# EAGLE design RapideUSBII (EAGLE 9.5.2)
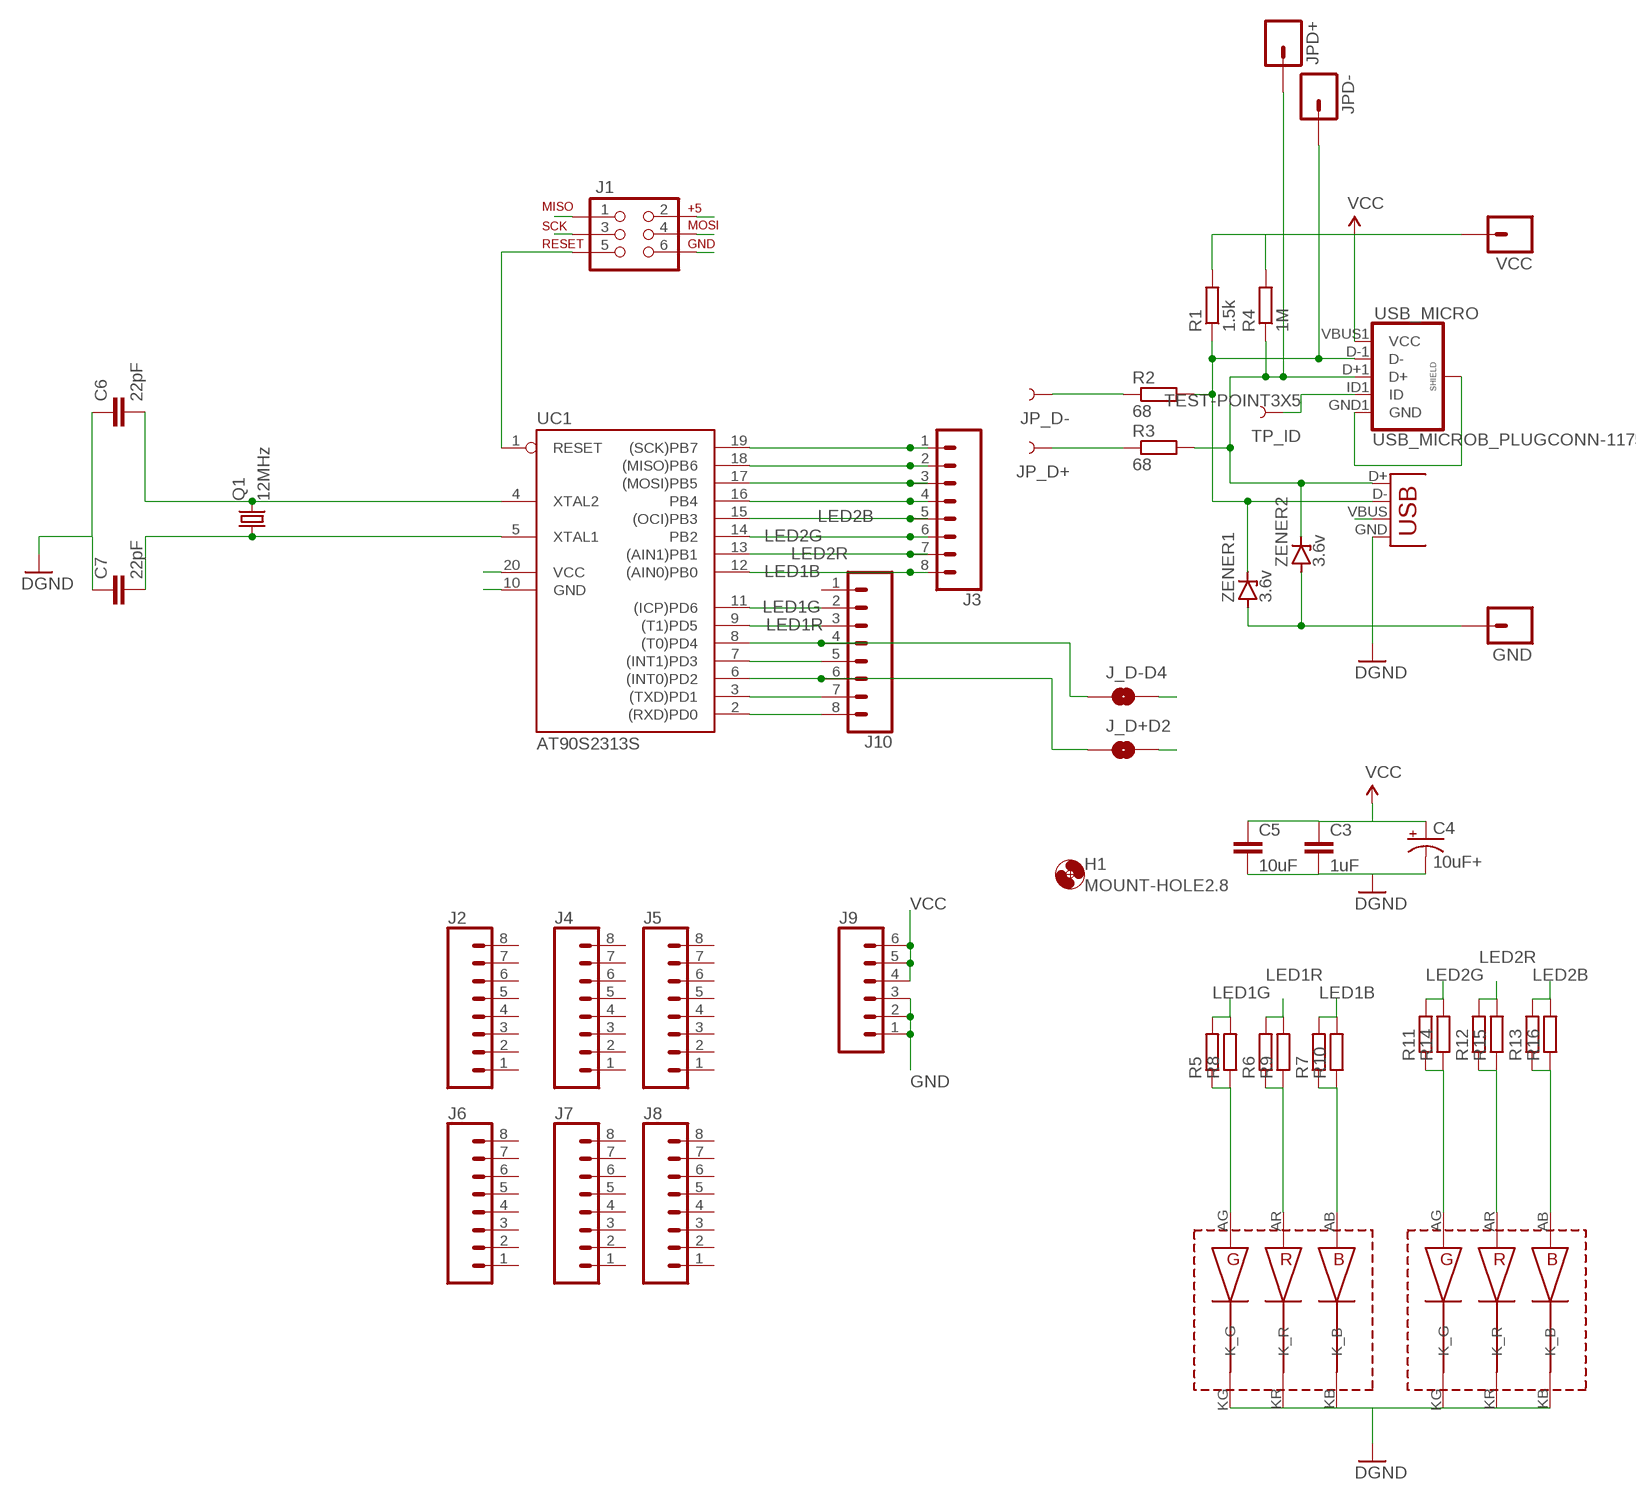
[diagram p0: schematic, sheet 1]

## Parts
C3  1uF  CAP1206  [1206]
C4  10uF+  CAP_POLE  [PANASONIC_E]
C5  10uF  CAP0805  [0805]
C6  22pF  CAP1206  [1206]
C7  22pF  CAP1206  [1206]
GND  M01PTH_NO_SILK_YES_STOP  [1X01_NO_SILK]
H1  MOUNT-HOLE2.8  [2,8]
J1  AVR_SPI_PRG_6PTH  [2X3]
J2  CONN_08NO_SILK_FEMALE_PTH  [1X08_NO_SILK]
J3  CONN_08SMD-STRAIGHT-ALT-FEMALE  [1X08_SMD_ALT]
J4  CONN_08NO_SILK_FEMALE_PTH  [1X08_NO_SILK]
J5  CONN_08NO_SILK_FEMALE_PTH  [1X08_NO_SILK]
J6  CONN_08NO_SILK_FEMALE_PTH  [1X08_NO_SILK]
J7  CONN_08NO_SILK_FEMALE_PTH  [1X08_NO_SILK]
J8  CONN_08NO_SILK_FEMALE_PTH  [1X08_NO_SILK]
J9  CONN_06NO_SILK_FEMALE_PTH  [1X06_NO_SILK]
J10  CONN_08SMD-STRAIGHT-FEMALE  [1X08_SMD]
J_D+D2  JUMPER-PAD-2-NOYES_SILK  [PAD-JUMPER-2-NO_YES_SILK]
J_D-D4  JUMPER-PAD-2-NOYES_SILK  [PAD-JUMPER-2-NO_YES_SILK]
JP_D+  TEST-POINT3X5  [PAD.03X.05]
JP_D-  TEST-POINT3X5  [PAD.03X.05]
JPD+  M01PTH_NO_SILK_YES_STOP  [1X01_NO_SILK]
JPD-  M01PTH_NO_SILK_YES_STOP  [1X01_NO_SILK]
LED1  RGB-SMT-SQUARE6X6MM  [SMT-SQUARE6]
LED2  RGB-SMT-SQUARE5X5MM  [SMT-SQUARE5]
Q1  12MHz  CRYSTALPTH-HC49UV  [HC49U]
R1  1.5k  R-EU_0204/2V  [0204V]
R2  68  R-EU_0204/2V  [0204V]
R3  68  R-EU_0204/2V  [0204V]
R4  1M  R-EU_0204/2V  [0204V]
R5  R-EU_0204/2V  [0204V]
R6  R-EU_0204/2V  [0204V]
R7  R-EU_0204/2V  [0204V]
R8  R-EU_M1206  [M1206]
R9  R-EU_M1206  [M1206]
R10  R-EU_M1206  [M1206]
R11  R-EU_0204/2V  [0204V]
R12  R-EU_0204/2V  [0204V]
R13  R-EU_0204/2V  [0204V]
R14  R-EU_M1206  [M1206]
R15  R-EU_M1206  [M1206]
R16  R-EU_M1206  [M1206]
TP_ID  TEST-POINT3X5  [PAD.03X.05]
UC1  AT90S2313S  [SO20L]
USB_MICRO  USB_MICROB_PLUGCONN-11752  [USB-B-MICRO-SMD_V03]
USB_MINI  USBSMD  [USB-MINIB]
VCC  M01PTH_NO_SILK_YES_STOP  [1X01_NO_SILK]
ZENER1  3.6v  ZENER-DIODEZD-2.5  [ZDIO-2.5]
ZENER2  3.6v  ZENER-DIODEZD-2.5  [ZDIO-2.5]

## Nets
D0: J10.8 UC1.2((RXD)PD0)
D1: J10.7 UC1.3((TXD)PD1)
D2: J10.6 J_D+D2.1 UC1.6((INT0)PD2)
D3: J10.5 UC1.7((INT1)PD3)
D4: J10.4 J_D-D4.1 UC1.8((T0)PD4)
D+: J_D+D2.2 JP_D+.P$1 R3.1
D-: J_D-D4.2 JP_D-.P$1 R2.1
GND: C3.2 C4.- C5.2 C6.1 C7.1 GND.1 J1.6 J9.1 J9.2 J9.3 LED1.KB(K_B) LED1.KG(K_G) LED1.KR(K_R) LED2.KB(K_B) LED2.KG(K_G) LED2.KR(K_R) UC1.10(GND) USB_MICRO.GND1(GND) USB_MICRO.SHIELD1(SHIELD) USB_MICRO.SHIELD2(SHIELD) USB_MICRO.SHIELD3(SHIELD) USB_MINI.GND ZENER1.A ZENER2.A ; supply symbol labelled DGND
LED1B: J3.8 R7.2 R10.2 UC1.12((AIN0)PB0)
LED1G: J10.2 R5.2 R8.2 UC1.11((ICP)PD6)
LED1R: J10.3 R6.2 R9.2 UC1.9((T1)PD5)
LED2B: J3.5 R13.2 R16.2 UC1.15((OCI)PB3)
LED2G: J3.6 R11.2 R14.2 UC1.14(PB2)
LED2R: J3.7 R12.2 R15.2 UC1.13((AIN1)PB1)
MISO: J1.1 J3.2 UC1.18((MISO)PB6)
MOSI: J1.4 J3.3 UC1.17((MOSI)PB5)
N$1: J3.4 UC1.16(PB4)
N$14: TP_ID.P$1 USB_MICRO.ID1(ID)
N$15: LED1.AG(ANODE_G) R5.1 R8.1
N$17: LED1.AR(ANODE_R) R6.1 R9.1
N$18: LED1.AB(ANODE_B) R7.1 R10.1
N$19: LED2.AG(ANODE_G) R11.1 R14.1
N$20: LED2.AR(ANODE_R) R12.1 R15.1
N$21: LED2.AB(ANODE_B) R13.1 R16.1
N$22: C7.2 Q1.1 UC1.5(XTAL1)
N$23: C6.2 Q1.2 UC1.4(XTAL2)
RESET: J1.5 UC1.1(RESET)
SCK: J1.3 J3.1 UC1.19((SCK)PB7)
USBD+: JPD+.1 R3.2 R4.1 USB_MICRO.D+1(D+) USB_MINI.D+ ZENER2.C
USBD-: JPD-.1 R1.1 R2.2 USB_MICRO.D-1(D-) USB_MINI.D- ZENER1.C
VCC: C3.1 C4.+ C5.1 J1.2 J9.4 J9.5 J9.6 R1.2 R4.2 UC1.20(VCC) USB_MICRO.VBUS1(VCC) USB_MINI.VBUS VCC.1
Unconnected: J2.1 J2.2 J2.3 J2.4 J2.5 J2.6 J2.7 J2.8 J4.1 J4.2 J4.3 J4.4 J4.5 J4.6 J4.7 J4.8 J5.1 J5.2 J5.3 J5.4 J5.5 J5.6 J5.7 J5.8 J6.1 J6.2 J6.3 J6.4 J6.5 J6.6 J6.7 J6.8 J7.1 J7.2 J7.3 J7.4 J7.5 J7.6 J7.7 J7.8 J8.1 J8.2 J8.3 J8.4 J8.5 J8.6 J8.7 J8.8 J10.1

## Library data of the parts
C3 C5-C7 = SparkFun-Capacitors:CAP: Capacitor Standard 0603 ceramic capacitor, and 0.1" leaded capacitor.
C4 = SparkFun-Capacitors:CAP_POL: Capacitor Polarized These are standard SMD and PTH capacitors. Normally 10uF, 47uF, and 100uF in electrolytic and tantalum varieties. Always verify the external diameter of the through hole cap, it varies with capacity, voltage, and manufacturer. The EIA devices should be standard.
GND JPD+ JPD- VCC = SparkFun-Connectors:M01: Header 1 Standard 1-pin 0.1" header. Use with straight break away headers (SKU : PRT-00116), right angle break away headers (PRT-00553), swiss pins (PRT-00743), machine pins (PRT-00117), and female headers (PRT-00115).
H1 = holes:MOUNT-HOLE: MOUNTING HOLE with drill center marker
J1 = SparkFun-Connectors:AVR_SPI_PRG_6: AVR ISP 6 Pin This is the reduced ISP connector for AVR programming. Common on Arduino. This footprint will take up less PCB space and can be used with a 10-pin to 6-pin adapter such as SKU: BOB-08508 **Special note about "TEST_POINT" package. The stop mask is on the top side, so if you want your programming test points to be on the bottom of your board, make sure to place this package on the bottom side of the board. This also ensure that the orientation to program from the bottom side will be correct.
J2 J4-J8 = SparkFun-Connectors:CONN_08: Multi connection point. Often used as Generic Header-pin footprint for 0.1 inch spaced/style header connections On any of the 0.1 inch spaced packages, you can populate with these: Break Away Headers - Straight <https://www.sparkfun.com/products/116> (PRT-00116) Break Away Male Headers - Right Angle <https://www.sparkfun.com/products/553> (PRT-00553) Female Headers <https://www.sparkfun.com/products/115> (PRT-00115) Break Away Headers - Machine Pin <https://www.sparkfun.com/products/117> (PRT-00117) Break Away Female Headers - Swiss Machine Pin <https://www.sparkfun.com/products/743> (PRT-00743) Arduino Stackable Header - 8 Pin <https://www.sparkfun.com/products/9279> (PRT-09279) For SCREWTERMINALS and SPRING TERMINALS visit here: Screw Terimnals on SparkFun.com <https://www.sparkfun.com/search/results?term=Screw+Terminals> (5mm/3.5mm/2.54mm spacing) This device is also useful as a general connection point to wire up your design to another part of your project. Our various solder wires solder well into these plated through hole pads. Hook-Up Wire - Assortment (Stranded, 22 AWG) <https://www.sparkfun.com/products/11375> (PRT-11375) Hook-Up Wire - Assortment (Solid Core, 22 AWG) <https://www.sparkfun.com/products/11367> (PRT-11367) View the entire wire category on our website here <https://www.sparkfun.com/categories/141> Special notes: Molex polarized connector foot print use with SKU : PRT-08231 with associated crimp pins and housings. 1MM SMD Version SKU: PRT-10208 NOTES ON THE VARIANTS LOCK and LOCK_LONGPADS... This footprint was designed to help hold the alignment of a through-hole component (i.e. 6-pin header) while soldering it into place. You may notice that each hole has been shifted either up or down by 0.005 of an inch from it's more standard position (which is a perfectly straight line). This slight alteration caused the pins (the squares in the middle) to touch the edges of the holes. Because they are alternating, it causes a "brace" to hold the component in place. 0.005 has proven to be the perfect amount of "off-center" position when using our standard breakaway headers. Although looks a little odd when you look at the bare footprint, once you have a header in there, the alteration is very hard to notice. Also,if you push a header all the way into place, it is covered up entirely on the bottom side.; PROD_ID: CONN-08438
J3 J10 = SparkFun-Connectors:CONN_08: Multi connection point. Often used as Generic Header-pin footprint for 0.1 inch spaced/style header connections On any of the 0.1 inch spaced packages, you can populate with these: Break Away Headers - Straight <https://www.sparkfun.com/products/116> (PRT-00116) Break Away Male Headers - Right Angle <https://www.sparkfun.com/products/553> (PRT-00553) Female Headers <https://www.sparkfun.com/products/115> (PRT-00115) Break Away Headers - Machine Pin <https://www.sparkfun.com/products/117> (PRT-00117) Break Away Female Headers - Swiss Machine Pin <https://www.sparkfun.com/products/743> (PRT-00743) Arduino Stackable Header - 8 Pin <https://www.sparkfun.com/products/9279> (PRT-09279) For SCREWTERMINALS and SPRING TERMINALS visit here: Screw Terimnals on SparkFun.com <https://www.sparkfun.com/search/results?term=Screw+Terminals> (5mm/3.5mm/2.54mm spacing) This device is also useful as a general connection point to wire up your design to another part of your project. Our various solder wires solder well into these plated through hole pads. Hook-Up Wire - Assortment (Stranded, 22 AWG) <https://www.sparkfun.com/products/11375> (PRT-11375) Hook-Up Wire - Assortment (Solid Core, 22 AWG) <https://www.sparkfun.com/products/11367> (PRT-11367) View the entire wire category on our website here <https://www.sparkfun.com/categories/141> Special notes: Molex polarized connector foot print use with SKU : PRT-08231 with associated crimp pins and housings. 1MM SMD Version SKU: PRT-10208 NOTES ON THE VARIANTS LOCK and LOCK_LONGPADS... This footprint was designed to help hold the alignment of a through-hole component (i.e. 6-pin header) while soldering it into place. You may notice that each hole has been shifted either up or down by 0.005 of an inch from it's more standard position (which is a perfectly straight line). This slight alteration caused the pins (the squares in the middle) to touch the edges of the holes. Because they are alternating, it causes a "brace" to hold the component in place. 0.005 has proven to be the perfect amount of "off-center" position when using our standard breakaway headers. Although looks a little odd when you look at the bare footprint, once you have a header in there, the alteration is very hard to notice. Also,if you push a header all the way into place, it is covered up entirely on the bottom side.; PROD_ID: CONN-10204; SF_ID: PRT-11543
J9 = SparkFun-Connectors:CONN_06: Multi connection point. Often used as Generic Header-pin footprint for 0.1 inch spaced/style header connections On any of the 0.1 inch spaced packages, you can populate with these: Break Away Headers - Straight <https://www.sparkfun.com/products/116> (PRT-00116) Break Away Male Headers - Right Angle <https://www.sparkfun.com/products/553> (PRT-00553) Female Headers <https://www.sparkfun.com/products/115> (PRT-00115) Break Away Headers - Machine Pin <https://www.sparkfun.com/products/117> (PRT-00117) Break Away Female Headers - Swiss Machine Pin <https://www.sparkfun.com/products/743> (PRT-00743) Arduino Stackable Header - 6 Pin <https://www.sparkfun.com/products/9280> (PRT-09280) For SCREWTERMINALS and SPRING TERMINALS visit here: Screw Terimnals on SparkFun.com <https://www.sparkfun.com/search/results?term=Screw+Terminals> (5mm/3.5mm/2.54mm spacing) This device is also useful as a general connection point to wire up your design to another part of your project. Our various solder wires solder well into these plated through hole pads. Hook-Up Wire - Assortment (Stranded, 22 AWG) <https://www.sparkfun.com/products/11375> (PRT-11375) Hook-Up Wire - Assortment (Solid Core, 22 AWG) <https://www.sparkfun.com/products/11367> (PRT-11367) View the entire wire category on our website here <https://www.sparkfun.com/categories/141>; PROD_ID: CONN-08437
J_D+D2 J_D-D4 = SparkFun-Passives:JUMPER-PAD-2-NO
JP_D+ JP_D- = SparkFun-Passives:TEST-POINT: Bare copper test points for troubleshooting or ICT
LED1 LED2 = kalshagar:RGB-SMT-SQUARE: A simple SMD RGB led square in about 6x6.6mm. Different models possible, be careful of the pinout (can be interverted so annotate your schema) Sold here http://akizukidenshi.com/catalog/g/gI-02225/
Q1 = SparkFun-Clocks:CRYSTAL: Crystals (Generic) These are passive quartz crystals, which can be used as a clock source for a microcontroller. Crystal's are two-terminal devices. They require external "load" capacitors to generate an oscillating signal.
R1-R16 = resistor:R-EU_: RESISTOR, European symbol
TP_ID = SparkFun-Connectors:TEST-POINT: SparkFun Test Points Bare copper test points for troubleshooting or In-Circuit-Testing. These are used by our Production team for verifying production board runs using pogo-pins on test beds. SparkFun Products: SparkFun LSM9DS1 Breakout <https://www.sparkfun.com/products/13284> SparkFun PSOC <https://www.sparkfun.com/products/13714> SparkFun Load Cell Amplifier <https://www.sparkfun.com/products/13879>
UC1 = atmel:AT90S2313: MICROCONTROLLER 2 Kbytes FLASH 128 bytes SRAM 128 bytes EEPROM UART; OC_FARNELL: unknown; OC_NEWARK: unknown
USB_MICRO = SparkFun-Connectors:USB_MICROB_PLUG: USB Micro-B connectors Some male, some female. Watch your step!; PROD_ID: CONN-11752
USB_MINI = SparkFun-Connectors:USB: USB Connectors USB-B-PTH is fully proven SKU : PRT-00139/CONN-08278 USB-miniB is fully proven SKU : PRT-00587 USB-A-PCB is untested. USB-A-H is throughly reviewed, but untested. Spark Fun Electronics SKU : PRT-00437 USB-B-SMT is throughly reviewed, but untested. Needs silkscreen touching up. USB-A-S has not been used/tested USB-MB-H has not been used/tested USB-MICROB has been used. CONN-09505; PROD_ID: CONN-08193
ZENER1 ZENER2 = diode:ZENER-DIODE: Z-Diode

## Board
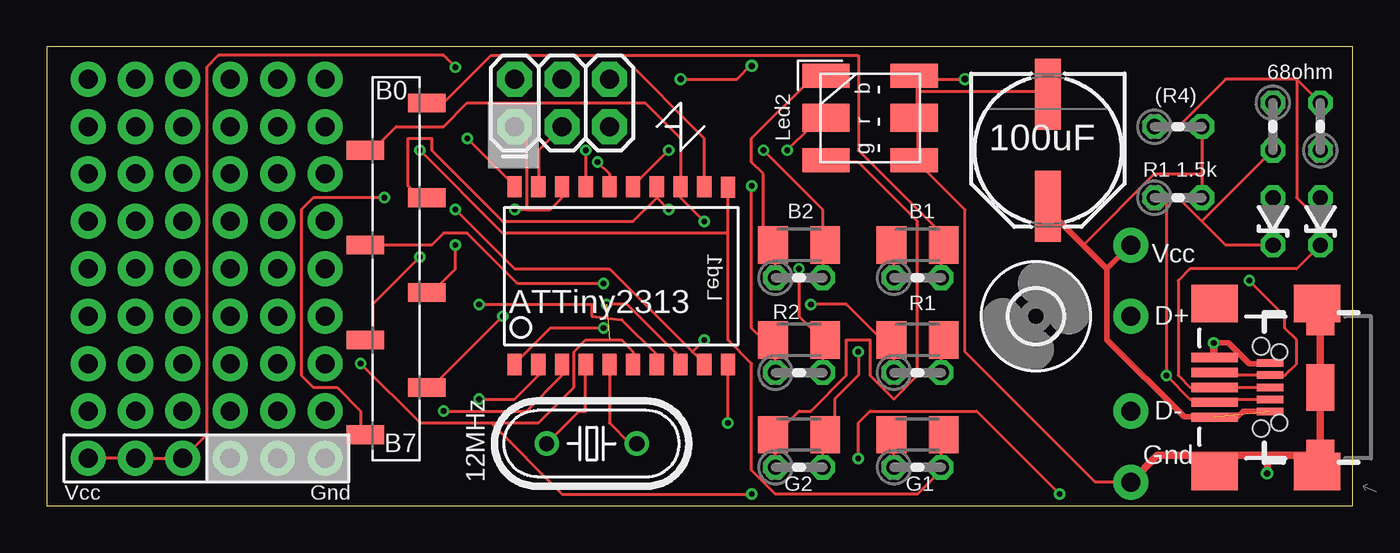
[diagram p1: board, top side]
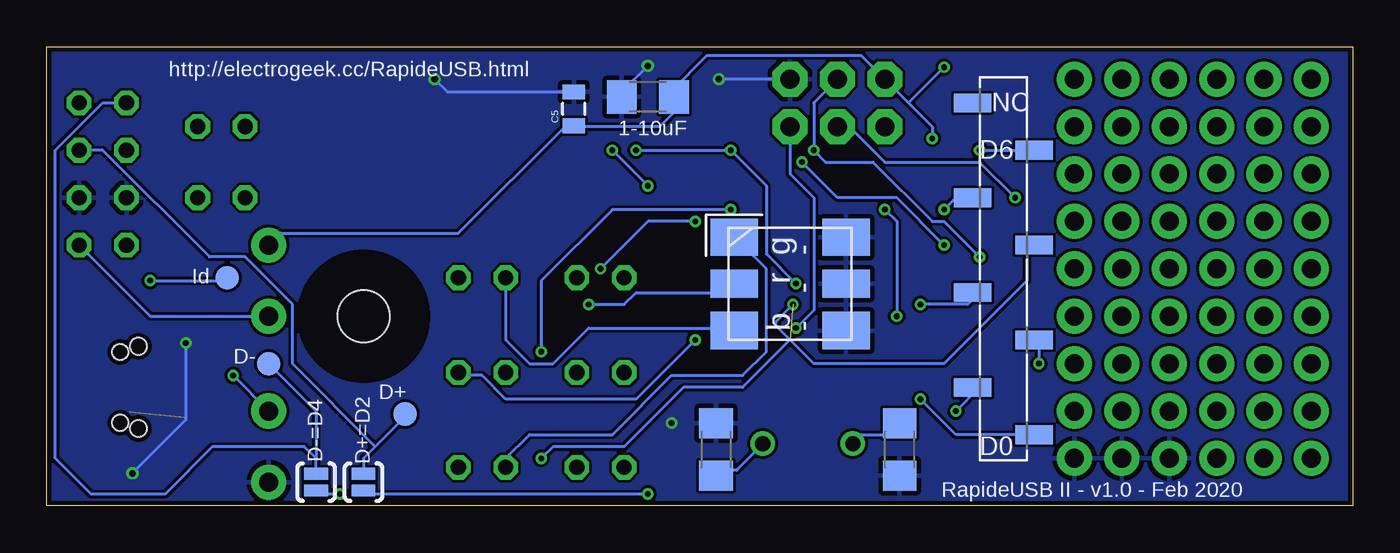
[diagram p2: board, bottom side, seen from below]

Size 70 x 24.6 mm. Coordinates in mm from the lower left corner, seen from the top.
Outline: 0,0 70,0 70,24.6 0,24.6 0,0
Copper layers (1*16): Top 0.035mm / dielectric 1.5mm / Bottom 0.035mm
Design rules "SeeedStudio_2layer_DRU_no_angle_20140221": minimum track width 6mil, minimum drill 12mil, track to track 6mil, track to pad 6mil, pad to pad 6mil, via to via 6mil, smd to smd 0mil, copper to edge 10mil, drill to drill 10mil, minimum pad ring 10mil, minimum via ring 6mil, stop-mask expansion 2mil, vias tented up to drill 100mil, thermal gap 10mil

### Footprints (pad centres in the part's own frame; a part is rotated, then mirrored left to right if it is on the bottom)
1206 = smd 1.6 x 1.8: 1 -1.4,0; 2 1.4,0
PANASONIC_E = smd 3.8 x 1.4: + 3,0; - -3,0
0805 = smd 0.8 x 1.2: 1 -0.9,0; 2 0.9,0
1X01_NO_SILK = drill 1.016 pad 1.88: 1 0,0
2,8 = hole 2.8: 0,0
2X3 = drill 1.016 pad 1.88 octagon: 1 0,0; 2 0,2.54; 3 2.54,0; 4 2.54,2.54; 5 5.08,0; 6 5.08,2.54
1X08_NO_SILK = drill 1.016 pad 1.88: 1 0,0; 2 2.54,0; 3 5.08,0; 4 7.62,0; 5 10.16,0; 6 12.7,0; 7 15.24,0; 8 17.78,0
1X08_SMD_ALT = smd 1 x 2: 1 0,-1.65; 2 -2.54,1.65; 3 -5.08,-1.65; 4 -7.62,1.65; 5 -10.16,-1.65; 6 -12.7,1.65; 7 -15.24,-1.65; 8 -17.78,1.65
1X06_NO_SILK = drill 1.016 pad 1.88: 1 0,0; 2 2.54,0; 3 5.08,0; 4 7.62,0; 5 10.16,0; 6 12.7,0
1X08_SMD = smd 1 x 2: 1 0,1.65; 2 -2.54,-1.65; 3 -5.08,1.65; 4 -7.62,-1.65; 5 -10.16,1.65; 6 -12.7,-1.65; 7 -15.24,1.65; 8 -17.78,-1.65
PAD-JUMPER-2-NO_YES_SILK = smd 0.635 x 1.27: 1 -0.45,0; 2 0.45,0
PAD.03X.05 = smd 1.27 x 1.27: P$1 0,0
SMT-SQUARE6 = smd 2 x 2.54: AB 0.5,3; AG 5.5,3; KB 0.5,-3; KG 5.5,-3 | smd 1.5 x 2.54: AR 3,3; KR 3,-3
SMT-SQUARE5 = smd 1.27 x 2.54: AB 4.628,4.905; AG 0.102,4.905; KB 4.628,0.175; KG 0.102,0.175 | smd 1.5 x 2.54: AR 2.365,4.905; KR 2.365,0.175
HC49U = drill 0.813: 1 -2.413,0; 2 2.413,0
0204V = drill 0.813 octagon: 1 -1.27,0; 2 1.27,0
M1206 = smd 1.6 x 2: 1 -1.4,0; 2 1.4,0
SO20L = smd 0.762 x 1.143: 1 -5.08,-5.131; 2 -3.81,-5.131; 3 -2.54,-5.131; 4 -1.27,-5.131; 5 0,-5.131; 6 1.27,-5.131; 7 2.54,-5.131; 8 3.81,-5.131; 9 5.08,-5.131; 10 6.35,-5.131; 11 6.35,4.369; 12 5.08,4.394; 13 3.81,4.394; 14 2.54,4.394; 15 1.27,4.394; 16 0,4.394; 17 -1.27,4.394; 18 -2.54,4.394; 19 -3.81,4.394; 20 -5.08,4.394
USB-B-MICRO-SMD_V03 = smd 1.4 x 0.4: D+1 2.7,0; D-1 2.7,0.65; GND1 2.7,-1.3; ID1 2.7,-0.65; VBUS1 2.7,1.3 | smd 1.5 x 1.8: SHIELD1 0,3.7; SHIELD2 0,-3.7 | smd 1.5 x 2.5: SHIELD3 0,0 | hole 0.85: 2.2,1.9; 2.2,-1.9
USB-MINIB = smd 2.5 x 0.5: D+ 2.5,0; D- 2.5,0.8; GND 2.5,-1.6; ID 2.5,-0.8; VBUS 2.5,1.6 | smd 2.5 x 2: MTN1 -3,4.5; MTN2 2.5,4.5; MTN3 -3,-4.5; MTN4 2.5,-4.5 | hole 0.9: 0,2.2; 0,-2.2
ZDIO-2.5 = drill 0.813 octagon: A 1.27,0; C -1.27,0

### Placement (x,y rotation side)
C3  37.78,21.91 180 bottom
C4  53.66,19.05 270 top
C5  41.75,21.27 90 bottom
C6  24.29,3.02 90 bottom
C7  34.13,3.02 270 bottom
GND  58.1,1.27 0 top
H1  53.02,10.16 0 top
J1  25.08,20.32 0 top
J2  14.92,5.08 90 top
J3  18.73,3.81 270 top
J4  12.38,5.08 90 top
J5  9.84,5.08 90 top
J6  7.3,5.08 90 top
J7  4.76,5.08 90 top
J8  2.22,5.08 90 top
J9  14.92,2.54 180 top
J10  18.73,21.59 90 bottom
J_D+D2  53.02,1.27 90 bottom
J_D-D4  55.56,1.27 90 bottom
JP_D+  50.8,4.92 0 bottom
JP_D-  58.1,7.62 0 bottom
JPD+  58.1,10.16 0 top
JPD-  58.1,5.08 0 top
LED1  30.16,8.89 90 bottom
LED2  46.67,18.41 90 top
Q1  29.21,3.33 180 top
R1  60.64,16.51 0 top
R2  65.72,20.32 270 top
R3  68.26,20.32 90 top
R4  60.64,20.32 0 top
R5  46.67,2.06 0 top
R6  46.67,7.14 0 top
R7  46.67,12.22 0 top
R8  46.67,3.81 0 top
R9  46.67,8.89 0 top
R10  46.67,13.97 0 top
R11  40.32,2.06 0 top
R12  40.32,7.14 0 top
R13  40.32,12.22 0 top
R14  40.32,3.81 0 top
R15  40.32,8.89 0 top
R16  40.32,13.97 0 top
TP_ID  60.32,12.22 0 bottom
U$1  [VUSB_LOGO]  56.51,16.51 0 bottom
UC1  30.16,12.7 0 top
USB_MICRO  68.26,6.35 180 top
USB_MINI  65.09,6.35 180 top
VCC  58.1,13.97 0 top
ZENER1  65.72,15.24 90 top
ZENER2  68.26,15.24 90 top

### Tracks (layer width: path | path; a pad name or v marks a point on that pad's centre or on a via)
D0  (via drill 0.3)
  Top 0.152: v23.18,5.71 25.08,5.71 26.35,6.99 UC1.2 26.35,7.62
  Bottom 0.152: v23.18,5.71 21.27,3.81 J10.8
D1  (via drill 0.3)
  Top 0.152: v21.27,5.08 25.71,5.08 27.62,6.99 UC1.3 27.62,7.62
  Bottom 0.152: v21.27,5.08 20,6.35 J10.7
D2  (via drill 0.3)
  Top 0.152: 23.81,4.45 20,4.45 v16.82,7.62 | 23.81,4.45 26.35,4.45 28.25,6.35 28.25,8.26 28.89,8.89 30.79,8.89 31.43,8.26 UC1.6 | v37.78,0.64 27.62,0.64 23.81,4.45
  Bottom 0.152: v16.82,7.62 16.82,8.89 J10.6 | v37.78,0.64 53.02,0.64 J_D+D2.1
D3  (via drill 0.3)
  Top 0.152: v23.18,10.79 29.25,10.79 29.21,10.76 29.21,10.16 30.82,9.98 32.7,8.1 UC1.7
  Bottom 0.152: v23.18,10.79 20.63,10.79 20,11.43 J10.5
D4  (via drill 0.3)  (1 unrouted)
  Top 0.152: UC1.8 33.7,7.84 33.7,8.2 31.11,10.79 v30,10.79 | v54.29,0.64 49.84,5.08 44.13,5.08 43.49,4.45 v43.49,2.54
  Bottom 0.152: v30,10.79 30.95,9.84 30.95,9.68 28.89,7.62 21.91,7.62 17.46,12.06 17.46,13.97 J10.4 | v54.29,0.64 55.56,0.64 J_D-D4.1 | v43.49,2.54 42.86,3.17 39.05,3.17 35.88,6.35 32.7,6.35 30.16,8.89
D+
  Bottom 0.152: J_D+D2.2 53.02,2.54 52.38,3.17 | 52.38,3.17 51.12,4.45 JP_D+.P$1 | R3.1 66.99,19.05 61.27,13.34 59.37,13.34 56.83,10.79 56.83,7.62 52.38,3.17
D-
  Bottom 0.152: 55.56,2.54 55.56,5.08 JP_D-.P$1 | R2.1 66.99,21.59 69.53,19.05 69.53,2.54 67.62,0.64 63.66,0.64 61.12,3.17 56.2,3.17 55.56,2.54 | J_D-D4.2 55.56,2.54
GND  (via drill 0.3, 0.35)
  Top 0.152: 46.67,22.23 46.67,20.95 LED2.KR 46.67,20.32 46.67,19.05 LED2.KG 46.67,18.41 49.21,15.88 49.21,8.26 56.2,1.27 GND.1 | 46.67,22.23 46.67,22.86 LED2.KB 46.68,22.86 v49.21,22.86 | 46.67,22.23 53.66,22.23 C4.- | v36.51,4.45 UC1.10 36.51,7.62 | 65.09,7.62 USB_MICRO.GND1 | 68.26,3.17 USB_MICRO.SHIELD1 | 62.55,7.99 USB_MINI.GND | v65.4,1.75 65.4,1.59 | v33.97,22.86 36.99,22.86 37.78,23.65 v37.78,23.57
  Top 0.305: 65.09,7.62 64.45,7.62 63.34,8.73 v62.55,8.73
  Top 0.406: USB_MICRO.SHIELD2 USB_MICRO.SHIELD3 68.26,3.17 68.26,2.7 65.4,2.7 | 65.4,2.7 59.53,2.7 GND.1 | v62.55,8.73 62.55,7.99 | v65.4,1.75 65.4,2.7
  Bottom 0.152: v62.55,8.73 62.55,4.6 v65.4,1.75 | J1.6 v33.97,22.86 | v37.78,23.57 39.18,22.17 C3.2 | v49.21,22.86 48.52,22.17 C5.2
  pour Bottom: -1.59,26.67 72.07,26.67 72.07,-1.27 -1.59,-1.27
LED1B
  Top 0.152: R7.2 47.94,13.97 | UC1.12 35.24,19.68 30.79,24.13 | 30.79,24.13 23.81,24.13 21.27,21.59 J3.8 | 47.94,13.97 47.94,14.61 43.49,19.05 43.49,24.13 30.79,24.13 | 47.94,13.97 R10.2
LED1G  (via drill 0.3)
  Top 0.152: 36.51,14.61 36.51,8.89 37.78,7.62 37.78,1.91 39.05,0.64 46.67,0.64 47.94,1.91 R5.2 47.94,3.81 R8.2 | 36.51,14.61 UC1.11 | v20,19.05 24.45,14.61 36.51,14.61
  Bottom 0.152: v20,19.05 J10.2
LED1R  (via drill 0.3)
  Top 0.152: R6.2 47.94,8.89 R9.2 | 34.6,8.26 30.16,12.7 25.08,12.7 v21.91,15.88 | 34.6,8.26 35.24,7.62 UC1.9 | 34.6,8.26 v35.24,8.89
  Bottom 0.152: v21.91,15.88 21.27,16.51 J10.3 | v35.24,8.89 38.41,5.71 45.4,5.71 46.67,6.99 47.94,6.99 R6.2
LED2B  (via drill 0.3)
  Top 0.152: v33.34,19.05 31.43,17.14 UC1.15 | v38.41,19.05 41.59,15.88 41.59,13.97 | J3.5 20.63,13.97 21.27,14.61 22.54,14.61 25.24,11.91 v29.84,11.91 | 41.59,13.97 R13.2 | 41.59,13.97 R16.2
  Bottom 0.152: v38.41,19.05 v33.34,19.05 31.43,17.14 31.43,13.49 v29.84,11.91
LED2G  (via drill 0.3)
  Top 0.152: R11.2 41.59,3.81 R14.2 42.23,3.81 42.23,5.71 43.49,6.99 v43.49,8.26 | 32.7,16.51 UC1.14 32.7,17.14 | 32.7,16.51 31.43,15.24 24.45,15.24 20.63,19.05 20.63,19.68 19.36,19.68 19.36,17.14 20,16.51 J3.6 | 32.7,16.51 v33.34,15.88
  Bottom 0.152: v43.49,8.26 43.49,12.06 39.69,15.88 v33.34,15.88
LED2R  (via drill 0.3)
  Top 0.152: R12.2 41.59,8.89 | J3.7 17.46,19.05 18.73,20.32 21.27,20.32 22.54,21.59 32.06,21.59 33.97,19.68 33.97,17.14 UC1.13 33.97,16.51 v35.24,15.24 | 41.59,8.89 40.32,10.16 v40.32,12.7 | 41.59,8.89 R15.2
  Bottom 0.152: v40.32,12.7 37.78,15.24 v35.24,15.24
MISO  (via drill 0.3)
  Top 0.152: 25.71,15.88 26.98,15.88 27.62,16.51 UC1.18 27.62,17.14 | 25.71,15.88 25.71,19.68 J1.1 | v24.45,10.16 20.63,6.35 J3.2 | 25.71,15.88 v25.08,15.88
  Bottom 0.152: v24.45,10.16 24.45,15.24 v25.08,15.88
MOSI  (via drill 0.3)
  Top 0.152: v28.89,19.05 UC1.17 | v20,13.34 17.46,10.79 17.46,8.89 J3.3
  Bottom 0.152: J1.4 28.89,21.59 v28.89,19.05 28.25,18.41 25.71,18.41 22.54,15.24 21.91,15.24 v20,13.34
N$1  (via drill 0.3)
  Top 0.152: UC1.16 30.16,17.78 v29.52,18.41 | v21.91,13.97 21.91,12.7 20.63,11.43 J3.4
  Bottom 0.152: v29.52,18.41 27.62,16.51 24.45,16.51 v21.91,13.97
N$2
  Top 0.152: 65.4,6.99 63.34,6.99
N$14  (via drill 0.3)
  Top 0.152: v64.45,12.06 66.36,10.16 66.36,9.53 66.99,8.89 66.99,7.62 66.36,6.99 65.72,6.99 USB_MICRO.ID1
  Bottom 0.152: v64.45,12.06 60.64,12.06 TP_ID.P$1
N$15
  Top 0.152: R5.1 45.4,3.81 R8.1
  Bottom 0.152: LED1.AG 32.7,13.97 31.43,12.7 31.43,8.26 32.7,6.99 36.51,6.99 39.69,3.81 44.13,3.81 45.4,2.54 R5.1
N$17  (via drill 0.3)
  Top 0.152: R6.1 45.4,8.89 R9.1 44.77,8.89 42.86,10.79 v40.95,10.79
  Bottom 0.152: v40.95,10.79 39.05,10.79 38.41,11.43 33.34,11.43 LED1.AR
N$18
  Top 0.152: R7.1 45.4,13.97 R10.1
  Bottom 0.152: R7.1 45.4,8.89 44.13,7.62 42.86,7.62 40.95,9.53 33.34,9.53 LED1.AB
N$19
  Top 0.152: R11.1 39.05,3.81 | 39.05,3.81 40.32,5.08 40.95,5.08 42.86,6.99 42.86,8.89 44.13,8.89 44.13,6.99 45.4,5.71 46.67,6.99 46.67,15.24 43.49,18.41 42.23,18.41 LED2.AG | 39.05,3.81 R14.1
N$20  (via drill 0.3)
  Top 0.152: R12.1 39.05,8.89 R15.1 38.41,8.89 37.78,9.53 v37.78,17.14 | v39.69,19.05 40.95,20.32 41.59,20.32 LED2.AR
  Bottom 0.152: v37.78,17.14 v39.69,19.05
N$21
  Top 0.152: R13.1 39.05,13.97 R16.1 38.41,13.97 38.41,17.78 37.78,18.41 37.78,19.68 40.95,22.86 41.59,22.86 LED2.AB
N$22
  Top 0.152: 30.16,7.62 UC1.5 30.16,4.45 31.27,3.33 Q1.1
  Bottom 0.152: C7.2 33.97,1.91 33.02,1.91 33.02,1.94 Q1.1
N$23
  Top 0.152: 28.89,7.62 UC1.4 28.89,5.08 28.54,5.08 Q1.2
  Bottom 0.152: C6.2 24.45,3.81 26.35,3.81 26.35,3.78 Q1.2
RESET  (via drill 0.3)
  Top 0.152: v29.84,9.53 26.98,9.53 25.08,7.62 UC1.1
  Bottom 0.152: v29.84,9.53 28.89,10.48 28.89,16.51 30.16,17.78 J1.5
SCK  (via drill 0.3)
  Top 0.152: UC1.19 26.35,19.05 J1.3 | v18.09,16.51 14.29,16.51 13.65,15.88 13.65,6.99 14.29,6.35 15.55,6.35 16.82,5.08 16.82,3.81 J3.1
  Bottom 0.152: v18.09,16.51 20,18.41 25.08,18.41 26.98,20.32 J1.3
USBD+
  Top 0.152: USB_MICRO.D+1 USB_MINI.D+ 61.27,6.35 60.64,6.99 60.64,12.06 61.27,12.7 66.99,12.7 ZENER2.C 68.26,15.24 66.99,16.51 66.99,22.86 | R4.1 60.64,20.32 63.18,22.86 66.99,22.86 | R3.2 66.99,22.86
  Bottom 0.152: JPD+.1 64.45,10.16 ZENER2.C
USBD-  (via drill 0.3)
  Top 0.152: USB_MICRO.D-1 65.09,5.71 63.18,5.71 USB_MINI.D- 62.55,5.71 61.27,5.71 v60.01,6.99 60.01,16.51 | 60.01,16.51 60.64,16.51 61.91,15.24 | 61.91,15.24 63.18,13.97 ZENER1.C | 61.91,15.24 R2.2 | 60.01,16.51 R1.1
  Bottom 0.152: v60.01,6.99 JPD-.1
VCC  (via drill 0.3)  (1 unrouted)
  Top 0.152: J9.6 J9.5 J9.4 8.57,3.81 8.57,23.5 9.21,24.13 21.27,24.13 v21.91,23.5 | v22.54,19.68 25.08,17.14 UC1.20 | R4.2 61.91,17.78 | 61.91,17.78 R1.2 | 65.09,5.08 USB_MICRO.VBUS1 | 53.66,15.88 C4.+ | 61.91,17.78 59.37,17.78 55.56,13.97
  Top 0.305: 65.09,5.08 64.13,5.08 63.82,4.76 60.96,4.76 56.83,8.89 56.83,12.7 | VCC.1 56.83,12.7 | 56.83,12.7 55.56,13.97 53.66,15.88
  Bottom 0.152: v22.54,19.68 22.54,20.32 23.81,21.59 | 23.81,21.59 J1.2 26.35,24.13 34.6,24.13 36.51,22.23 C3.1 35.88,21.59 37.15,20.32 41.59,20.32 C5.1 42.23,20.32 47.94,14.61 57.46,14.61 VCC.1 | 23.81,21.59 v21.91,23.5

### Text on the board
tPlace: Vcc | Gnd
tNames: B0 | B7
bNames: http://electrogeek.cc/RapideUSB.html | NC | 1-10uF | D6 | Id | D- | D+ | D+=D2 | D-=D4 | D0 | RapideUSB II - v1.0 - Feb 2020
_tNames: 68ohm | (R4) | Led2 | 100uF | R1 1.5k | B2 | B1 | Vcc | Led1 | ATTiny2313 | R2 | R1 | D+ | D- | Gnd | 12MHz | G2 | G1